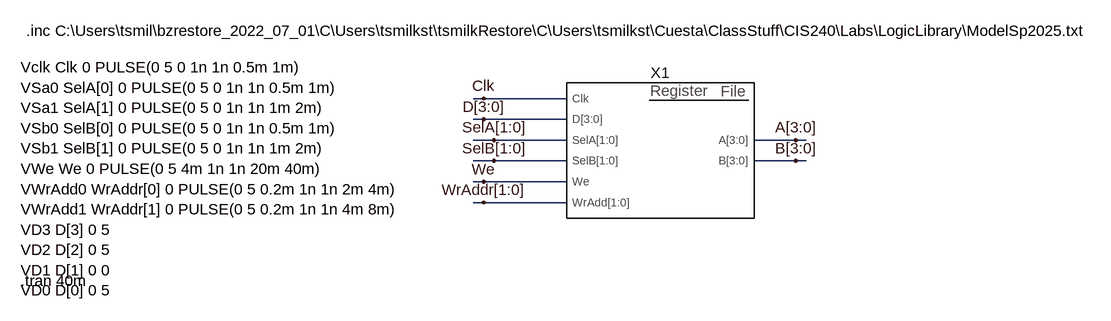
[diagram p0: schematic RegFileTest.asc]
RegFileTest.asc, the LTspice schematic file:
Version 4.1
SHEET 1 1080 680
WIRE -80 80 -96 80
WIRE 48 80 -80 80
WIRE -80 112 -96 112
WIRE 48 112 -80 112
WIRE -64 144 -96 144
WIRE 48 144 -64 144
WIRE 400 144 336 144
WIRE 416 144 400 144
WIRE -64 176 -96 176
WIRE 48 176 -64 176
WIRE 400 176 336 176
WIRE 416 176 400 176
WIRE -80 208 -96 208
WIRE 48 208 -80 208
WIRE -80 240 -96 240
WIRE 48 240 -80 240
FLAG 400 144 A[3:0]
FLAG 400 176 B[3:0]
FLAG -80 80 Clk
FLAG -80 208 We
FLAG -80 240 WrAddr[1:0]
FLAG -64 144 SelA[1:0]
FLAG -64 176 SelB[1:0]
FLAG -80 112 D[3:0]
SYMBOL RegisterBank 192 160 R0
SYMATTR InstName X1
TEXT -792 32 Left 2 !Vclk Clk 0 PULSE(0 5 0 1n 1n 0.5m 1m)\nVSa0 SelA[0] 0 PULSE(0 5 0 1n 1n 0.5m 1m)\nVSa1 SelA[1] 0 PULSE(0 5 0 1n 1n 1m 2m)\nVSb0 SelB[0] 0 PULSE(0 5 0 1n 1n 0.5m 1m)\nVSb1 SelB[1] 0 PULSE(0 5 0 1n 1n 1m 2m)\nVWe We 0 PULSE(0 5 4m 1n 1n 20m 40m)\nVWrAdd0 WrAddr[0] 0 PULSE(0 5 0.2m 1n 1n 2m 4m)\nVWrAdd1 WrAddr[1] 0 PULSE(0 5 0.2m 1n 1n 4m 8m)\nVD3 D[3] 0 5\nVD2 D[2] 0 5\nVD1 D[1] 0 0\nVD0 D[0] 0 5
TEXT -784 -24 Left 2 !.inc C:\\Users\\tsmil\\bzrestore_2022_07_01\\C\\Users\\tsmilkst\\tsmilkRestore\\C\\Users\\tsmilkst\\Cuesta\\ClassStuff\\CIS240\\Labs\\LogicLibrary\\ModelSp2025.txt
TEXT -792 360 Left 2 !.tran 40m

The netlist it stands for:
* RegFileTest.asc
X§X1 Clk D[3] D[2] D[1] D[0] SelA[1] SelA[0] SelB[1] SelB[0] We WrAddr[1] WrAddr[0] A[3] A[2] A[1] A[0] B[3] B[2] B[1] B[0] RegisterBank  ; pins Clk D[3:0] SelA[1:0] SelB[1:0] We WrAdd[1:0] A[3:0] B[3:0]
Vclk Clk 0 PULSE(0 5 0 1n 1n 0.5m 1m)
VSa0 SelA[0] 0 PULSE(0 5 0 1n 1n 0.5m 1m)
VSa1 SelA[1] 0 PULSE(0 5 0 1n 1n 1m 2m)
VSb0 SelB[0] 0 PULSE(0 5 0 1n 1n 0.5m 1m)
VSb1 SelB[1] 0 PULSE(0 5 0 1n 1n 1m 2m)
VWe We 0 PULSE(0 5 4m 1n 1n 20m 40m)
VWrAdd0 WrAddr[0] 0 PULSE(0 5 0.2m 1n 1n 2m 4m)
VWrAdd1 WrAddr[1] 0 PULSE(0 5 0.2m 1n 1n 4m 8m)
VD3 D[3] 0 5
VD2 D[2] 0 5
VD1 D[1] 0 0
VD0 D[0] 0 5
.inc C:\Users\tsmil\bzrestore_2022_07_01\C\Users\tsmilkst\tsmilkRestore\C\Users\tsmilkst\Cuesta\ClassStuff\CIS240\Labs\LogicLibrary\ModelSp2025.txt
.tran 40m
.backanno
.end